# EAGLE design powersuppy-v10 (EAGLE 5.10)
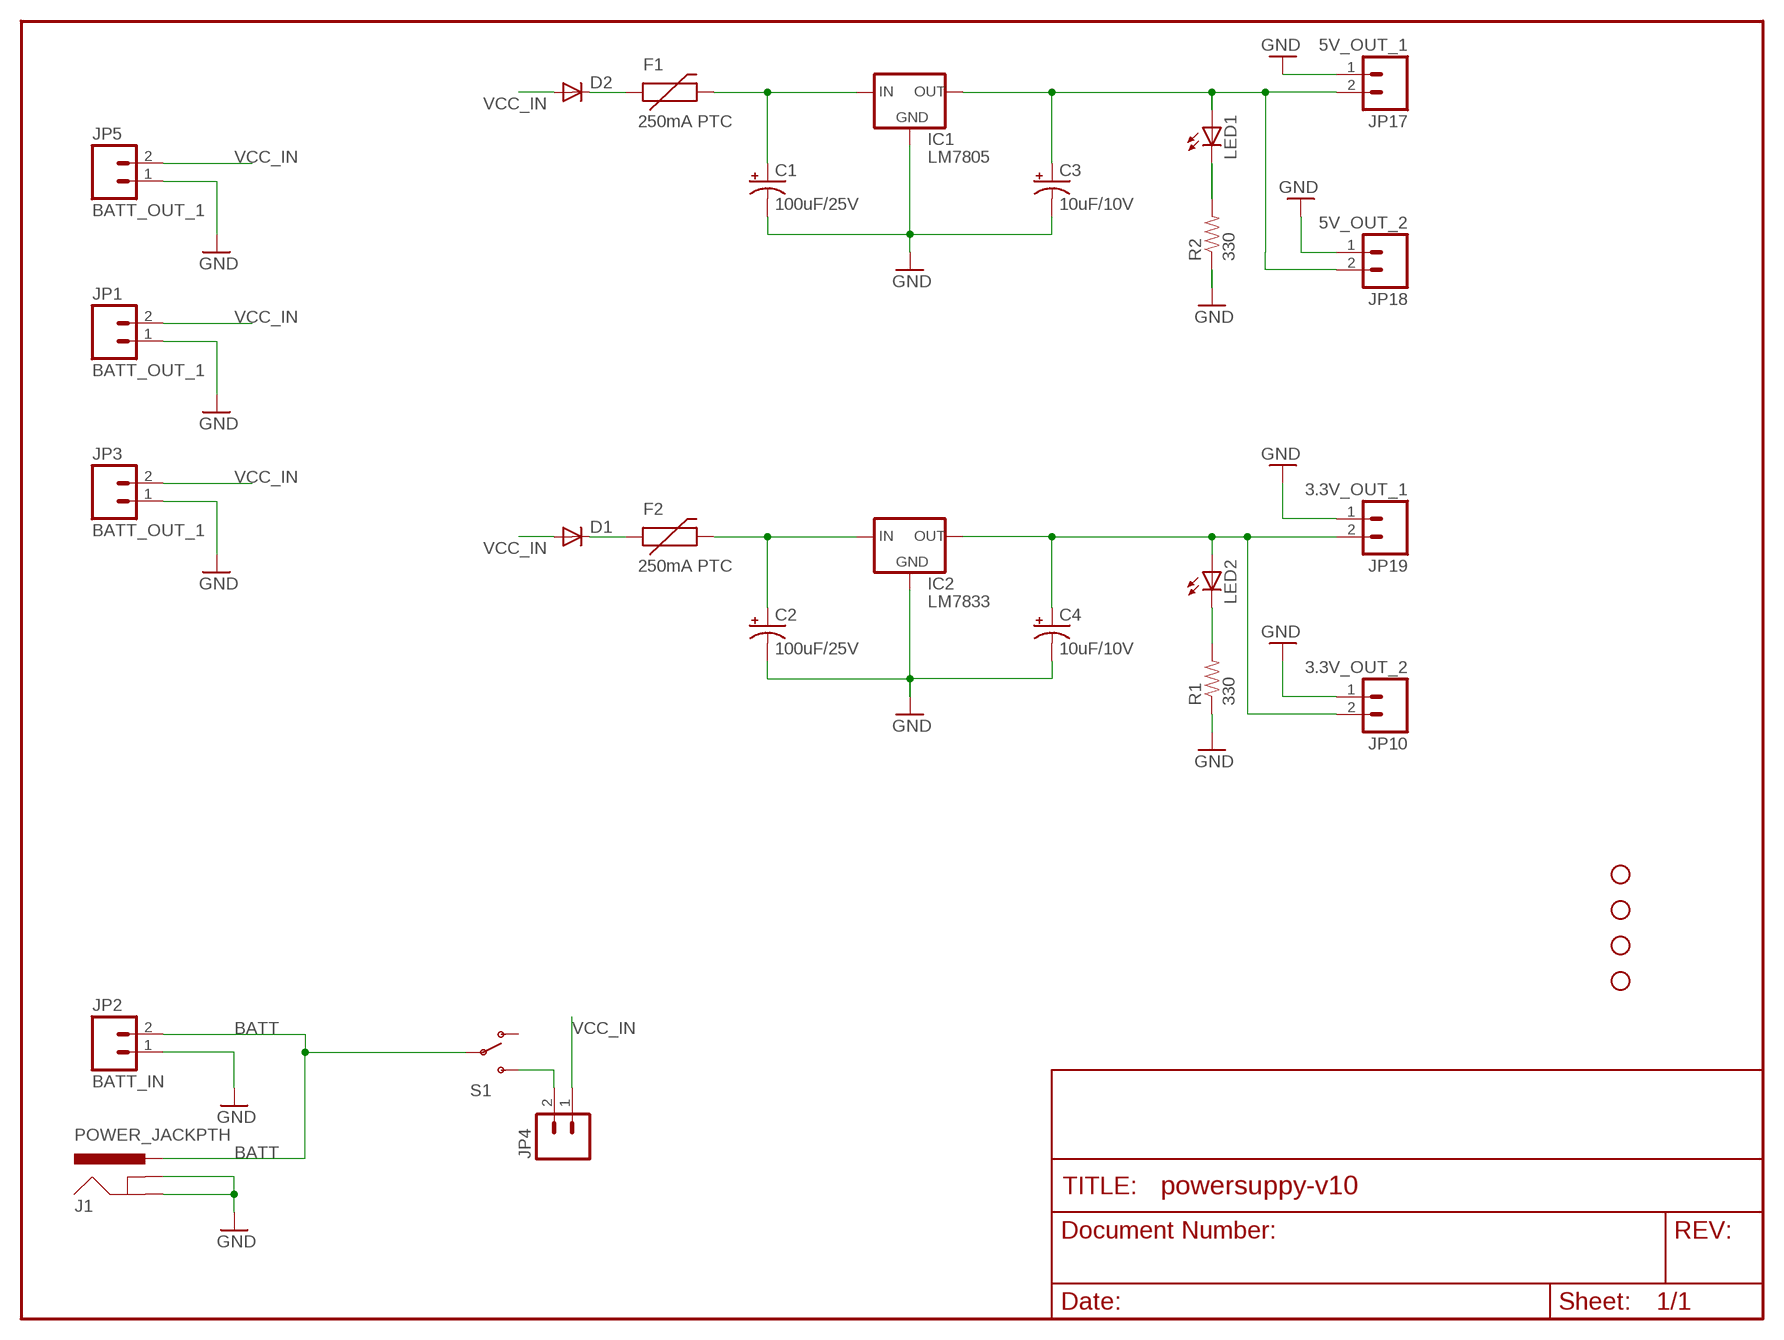
[diagram p0: schematic, sheet 1]

## Parts
C1  100uF/25V  CAP_POLPTH1  [CPOL-RADIAL-100UF-25V]
C2  100uF/25V  CAP_POLPTH1  [CPOL-RADIAL-100UF-25V]
C3  10uF/10V  CAP_POLPTH2  [CPOL-RADIAL-10UF-25V]
C4  10uF/10V  CAP_POLPTH2  [CPOL-RADIAL-10UF-25V]
D1  DIODEPTH  [DIODE-1N4001]
D2  DIODEPTH  [DIODE-1N4001]
F1  250mA PTC  PTCPTH  [PTC]
F2  250mA PTC  PTCPTH  [PTC]
IC1  LM7805  V_REG_78XXSIDE  [78XXL]
IC2  LM7833  V_REG_78XXSIDE  [78XXL]
J1  POWER_JACKPTH  [POWER_JACK_PTH]
JP1  BATT_OUT_1  M02POLAR  [MOLEX-1X2]
JP2  BATT_IN  M02POLAR  [MOLEX-1X2]
JP3  BATT_OUT_1  M02POLAR  [MOLEX-1X2]
JP4  M02PTH  [1X02]
JP5  BATT_OUT_1  M02POLAR  [MOLEX-1X2]
JP10  3.3V_OUT_2  M02POLAR  [MOLEX-1X2]
JP11  STAND-OFF  [STAND-OFF]
JP12  STAND-OFF  [STAND-OFF]
JP13  STAND-OFF  [STAND-OFF]
JP14  STAND-OFF  [STAND-OFF]
JP17  5V_OUT_1  M02POLAR  [MOLEX-1X2]
JP18  5V_OUT_2  M02POLAR  [MOLEX-1X2]
JP19  3.3V_OUT_1  M02POLAR  [MOLEX-1X2]
LED1  LED3MM  [LED3MM]
LED2  LED3MM  [LED3MM]
R1  330  RESISTORPTH1  [AXIAL-0.3]
R2  330  RESISTORPTH1  [AXIAL-0.3]
S1  SWITCH-SPSTPTH_LOCK  [SWITCH-SPDT_LOCK.007S]

## Nets
3.3V: C4.1(+) IC2.OUT JP10.2 JP19.2 LED2.A
5V: C3.1(+) IC1.OUT JP17.2 JP18.2 LED1.A
BATT: J1.PWR JP2.2 S1.2(P)
GND: C1.2(-) C2.2(-) C3.2(-) C4.2(-) IC1.GND IC2.GND J1.GND J1.GNDBREAK JP1.1 JP2.1 JP3.1 JP5.1 JP10.1 JP17.1 JP18.1 JP19.1 R1.P$1 R2.P$1
N$1: C1.1(+) F1.P$2 IC1.IN
N$2: LED1.K(C) R2.P$2
N$3: D1.C F2.P$1
N$4: JP4.2 S1.3(S)
N$5: LED2.K(C) R1.P$2
N$7: C2.1(+) F2.P$2 IC2.IN
N$8: D2.C F1.P$1
VCC_IN: D1.A D2.A JP1.2 JP3.2 JP4.1 JP5.2
Unconnected: S1.1(O)

## Library data of the parts
C1-C4 = SparkFun:CAP_POL: Capacitor Polarized These are standard SMD and PTH capacitors. Normally 10uF, 47uF, and 100uF in electrolytic and tantalum varieties. Always verify the external diameter of the through hole cap, it varies with capacity, voltage, and manufacturer. The EIA devices should be standard.
D1 D2 = SparkFun:DIODE: Diode These are standard reverse protection diodes and small signal diodes. SMA package can handle up to about 1A. SOD-323 can handle about 200mA. What the SOD-323 package when ordering, there are some mfgs out there that are 5-pin packages.
F1 F2 = SparkFun:PTC: Resettable Fuse PTC Resettable Fuse. Spark Fun Electronics SKU : COM-08357
IC1 IC2 = SparkFun:V_REG_78XX: Voltage Regulator Standard 7805 5V regulator. IGO (Input Ground Output). Spark Fun Electronics SKU : COM-00107
J1 = SparkFun:POWER_JACK: Power Jack This is the standard 5.5mm barrel jack for power. The PTH is the most common, proven, reliable, footprint. All others are experimental. The Slot footprint only works if the mill layer is transmitted to the PCB fab house so be warned. Spark Fun Electronics SKU : PRT-00119. Mating wall wart : TOL-00298 (and others)
JP1-JP5 JP10 JP17-JP19 = SparkFun:M02: Header 2 Standard 2-pin 0.1" header. Use with straight break away headers (SKU : PRT-00116), right angle break away headers (PRT-00553), swiss pins (PRT-00743), machine pins (PRT-00117), and female headers (PRT-00115). Molex polarized connector foot print use with SKU : PRT-08233 with associated crimp pins and housings.
JP11-JP14 = SparkFun:STAND-OFF: Stand Off This is the mechanical footprint for a #4 phillips button head screw. Use the keepout ring to avoid running the screw head into surrounding components. SKU : PRT-00447
LED1 LED2 = SparkFun:LED: LEDs Standard schematic elements and footprints for 5mm, 3mm, 1206, and 0603 sized LEDs. 5mm - Spark Fun Electronics SKU : COM-00529 (and others)
R1 R2 = SparkFun:RESISTOR: Resistor Basic schematic elements and footprints for 0603, 1206, and PTH 1/10th watt (small) resistors.
S1 = SparkFun:SWITCH-SPST: SPST Switch Simple slide switch. Spark Fun Electronics SKU : COM-00102

## Net classes
0 default: width 0.813 mm, clearance 0.813 mm

## Board
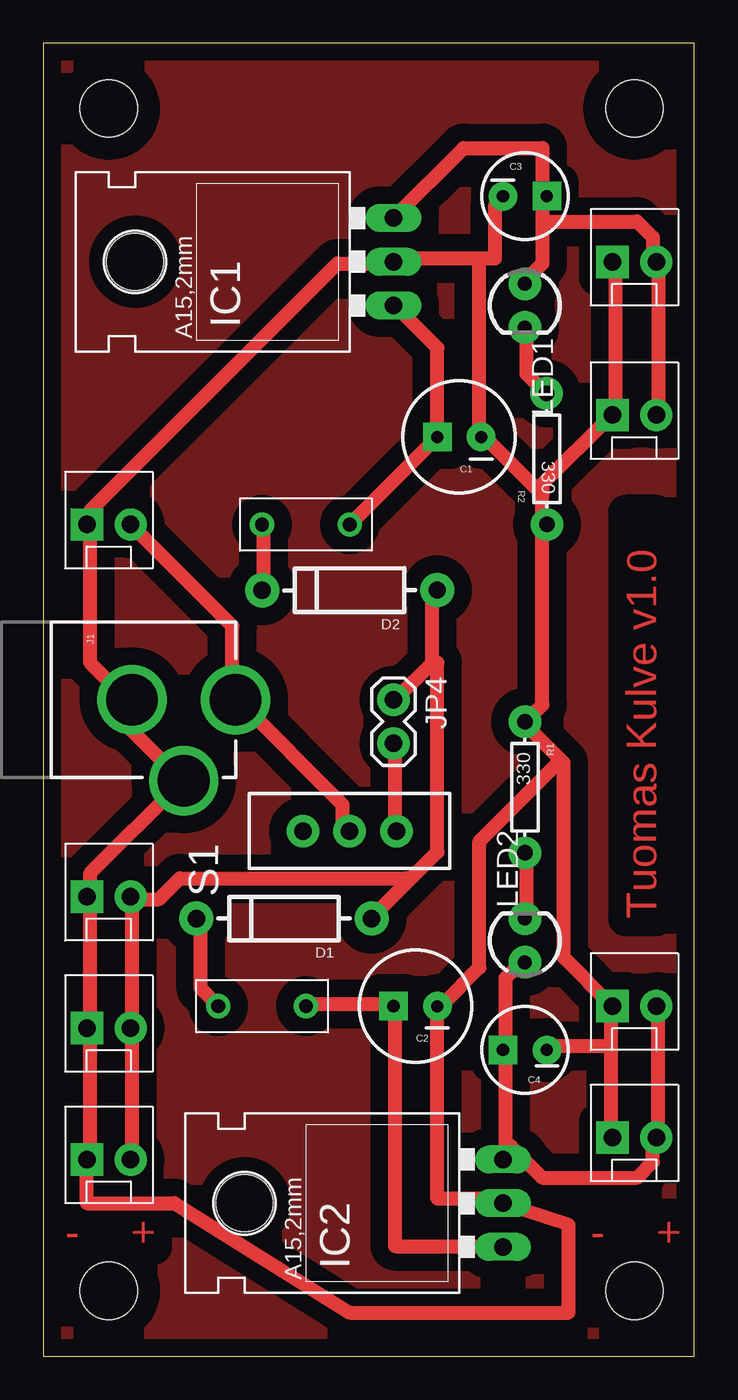
[diagram p1: board, top side]

Size 37.77 x 76.19 mm. Coordinates in mm from the lower left corner, seen from the top.
Outline: 0,0 37.77,0 37.77,76.19 0,76.19 0,0
Copper layers (1*16): Top 0.035mm / dielectric 1.5mm / Bottom 0.035mm
Design rules "SparkFun *": minimum track width 24mil, minimum drill 20mil, track to track 24mil, track to pad 24mil, pad to pad 24mil, via to via 24mil, smd to smd 24mil, copper to edge 24mil, drill to drill 24mil, minimum pad ring 12mil, minimum via ring 10mil, stop-mask expansion 4mil, vias tented up to drill 25mil, thermal gap 10mil

### Footprints (pad centres in the part's own frame; a part is rotated, then mirrored left to right if it is on the bottom)
CPOL-RADIAL-100UF-25V = drill 0.7 pad 1.651 square: 1 1.27,0 | drill 0.7 pad 1.651 round: 2 -1.27,0
CPOL-RADIAL-10UF-25V = drill 0.7 pad 1.651 square: 1 1.27,0 | drill 0.7 pad 1.651 round: 2 -1.27,0
DIODE-1N4001 = drill 1 pad 1.981 round: A -5.08,0; C 5.08,0
PTC = drill 0.8 round: P$1 -2.54,0; P$2 2.54,0
78XXL = drill 1.016 long: GND 0,-3.81; IN -2.54,-3.81; OUT 2.54,-3.81 | hole 3.302: 0,11.176
POWER_JACK_PTH = drill 2.997 round: GND 0,7.7; GNDBREAK 4.7,10.7; PWR 0,13.7
MOLEX-1X2 = drill 1.016 pad 1.88 square: 1 0,0 | drill 1.016 pad 1.88 round: 2 2.54,0
1X02 = drill 1.016 pad 1.88 round: 1 0,0; 2 2.54,0
STAND-OFF = hole 3.302: 0,0
LED3MM = drill 0.813 pad 1.88 round: A -1.27,0; K 1.27,0
AXIAL-0.3 = drill 0.9 pad 1.88 round: P$1 -3.81,0; P$2 3.81,0
SWITCH-SPDT_LOCK.007S = drill 1.016 pad 1.88 round: 1 0,2.718; 2 0,0; 3 0,-2.718

### Placement (x,y rotation side)
C1  24.13,53.34 180 top
C2  21.59,20.32 179.9 top
C3  27.94,67.31 0.1 top
C4  27.94,17.78 180 top
D1  13.97,25.4 180 top
D2  17.78,44.45 180.1 top
F1  15.24,48.26 0 top
F2  12.7,20.32 0 top
IC1  16.51,63.5 90 top
IC2  22.86,8.89 90 top
J1  -2.54,38.1 270 top
JP1  2.54,19.05 0 top
JP2  2.54,48.26 0 top
JP3  2.54,11.43 0 top
JP4  20.32,38.1 270 top
JP5  2.54,26.67 0 top
JP10  33.02,12.7 0 top
JP11  34.29,3.81 0 top
JP12  3.81,3.81 0 top
JP13  3.81,72.39 0 top
JP14  34.29,72.39 0 top
JP17  33.02,54.61 0 top
JP18  33.02,63.5 0 top
JP19  33.02,20.32 0 top
LED1  27.94,60.96 270 top
LED2  27.94,24.13 90 top
R1  27.94,33.02 270 top
R2  29.21,52.07 90.1 top
S1  17.78,30.48 90 top

### Tracks (layer width: path | path; a pad name or v marks a point on that pad's centre or on a via)
3.3V
  Top 0.813: JP19.2 35.66,20.12 35.66,12.8 JP10.2 35.36,12.5 35.36,11.28 34.44,10.36 28.96,10.36 27.13,12.19 IC2.OUT 26.82,11.58 26.82,17.68 C4.1 26.82,17.98 26.82,21.95 27.74,22.86 LED2.A
5V
  Top 0.813: JP17.2 35.66,54.86 35.66,63.4 JP18.2 35.36,63.7 35.36,64.92 34.44,65.84 28.96,65.84 | IC1.OUT 24.38,70.1 28.96,70.1 28.96,67.36 C3.1 28.96,67.06 28.96,65.84 | 28.96,65.84 28.96,63.4 28.04,62.48 LED1.A
BATT
  Top 0.813: S1.2 17.68,30.48 17.37,30.79 17.37,32 11.28,38.1 J1.PWR 10.97,38.41 10.97,42.37 JP2.2
GND
  Top 0.813: 32.92,17.98 29.26,17.98 C4.2 | 32.92,17.98 32.92,20.12 JP19.1 30.18,23.16 30.18,34.44 | JP10.1 32.92,12.8 32.92,17.98 | 25.3,63.7 26.21,63.7 26.21,66.75 26.52,67.06 C3.2 | 25.3,63.7 20.42,63.7 IC1.GND 20.12,63.4 17.07,63.4 2.74,49.07 2.74,48.46 JP2.1 2.74,48.16 2.74,40.23 4.88,38.1 J1.GND 5.18,37.8 5.18,36.27 7.92,33.53 J1.GNDBREAK 7.92,33.22 2.74,28.04 2.74,26.82 JP5.1 2.74,26.52 2.74,19.2 JP1.1 2.74,18.9 2.74,11.58 JP3.1 2.54,8.89 7.62,8.89 17.78,2.54 30.48,2.54 30.48,7.62 IC2.GND 26.52,9.14 22.86,9.14 22.86,20.12 C2.2 23.16,20.42 25.3,22.55 25.3,29.87 29.87,34.44 30.18,34.44 | 28.8,50.14 28.96,49.99 28.96,48.46 R2.P$1 28.96,48.16 28.96,37.8 28.04,36.88 R1.P$1 28.04,36.58 30.18,34.44 | 28.8,50.14 25.6,53.34 C1.2 25.3,53.65 25.3,63.7 | 28.8,50.14 28.96,50.29 28.96,50.6 32.92,54.56 JP17.1 33.22,54.86 33.22,63.4 JP18.1
N$1
  Top 0.813: F1.P$2 C1.1 22.86,58.52 20.42,60.96 IC1.IN
N$2
  Top 0.813: R2.P$2 28.96,56.08 28.04,57 28.04,59.44 LED1.K
N$3
  Top 0.813: F2.P$1 9.14,21.34 9.14,25.3 D1.C
N$4
  Top 0.813: JP4.2 20.42,35.36 20.42,30.48 S1.3
N$5
  Top 0.813: LED2.K 28.04,25.6 28.04,28.96 R1.P$2
N$6
  pour Top (isolate 1.016): 0,76.2 38.1,76.2 38.1,0 0,0
N$7
  Top 0.813: F2.P$2 15.24,20.42 20.12,20.42 C2.1 20.42,20.12 20.42,6.4 26.52,6.4 IC2.IN
N$8
  Top 0.813: F1.P$1 12.8,48.16 12.8,44.5 D2.C
VCC_IN
  Top 0.813: JP3.2 5.18,11.58 5.18,18.9 JP1.2 5.18,19.2 5.18,26.52 JP5.2 5.49,26.52 6.71,26.52 7.92,27.74 21.03,27.74 21.18,27.58 | 22.55,40.23 20.42,38.1 JP4.1 | 22.55,40.23 22.55,44.2 D2.A | 21.18,27.58 22.86,29.26 22.86,40.23 22.55,40.23 | 21.18,27.58 19.2,25.6 D1.A

### Text on the board
Top: Tuomas Kulve v1.0 | - | + | - | +